# Altium schematic sheet Cabinet_Host.SchDoc
size A4
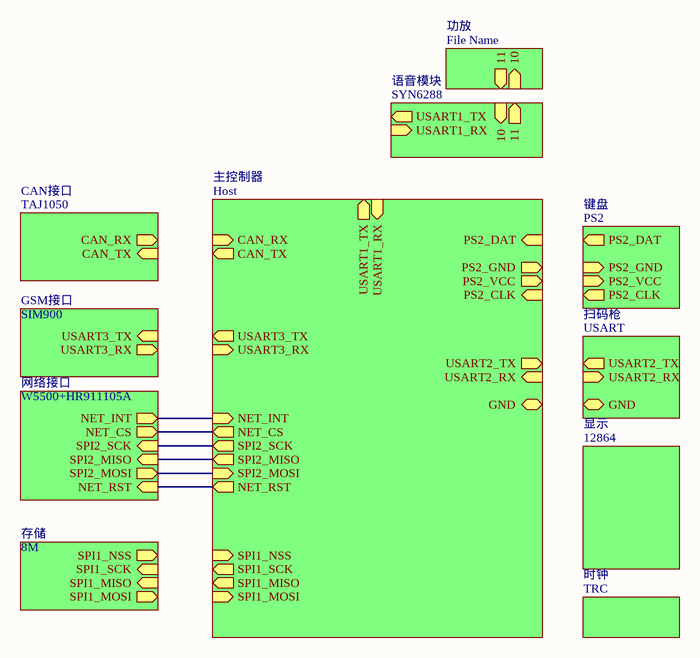
[diagram p0: Cabinet_Host.SchDoc]

## Sub-sheets
CAN接口 = TAJ1050: CAN_RX (out), CAN_TX (in)
GSM接口 = SIM900: USART3_RX (out), USART3_TX (in)
主控制器 = Host: CAN_TX (out), CAN_RX (in), NET_CS (out), SPI2_SCK (out), SPI2_MISO (out), SPI2_MOSI (in), USART3_TX (out), USART3_RX (in), USART2_TX (out), USART2_RX (in), PS2_DAT (in), PS2_GND (out), PS2_VCC (out), PS2_CLK (in), SPI1_NSS (in), SPI1_SCK (out), SPI1_MISO (out), SPI1_MOSI (in), USART1_TX (out), USART1_RX (in), GND, NET_RST (out), NET_INT (in)
功放 = File Name: 10 (in), 11 (out)
存储 = 8M: SPI1_NSS (out), SPI1_MISO (in), SPI1_MOSI (out), SPI1_SCK (in)
扫码枪 = USART: USART2_TX (out), USART2_RX (in), GND  | Value: 5V 500mA
时钟 = TRC: no entries
显示 = 12864: no entries
网络接口 = W5500+HR911105A: NET_CS (out), SPI2_MISO (in), SPI2_MOSI (out), SPI2_SCK (in), NET_RST (in), NET_INT (out)
语音模块 = SYN6288: USART1_TX (out), USART1_RX (in), 10 (in), 11 (out)
键盘 = PS2: PS2_DAT (out), PS2_GND (in), PS2_VCC (in), PS2_CLK (out)  | model: YLGF HS87-S16

## Nets
(unnamed): sheet 主控制器/NET_CS, sheet 网络接口/NET_CS
(unnamed): sheet 主控制器/SPI2_SCK, sheet 网络接口/SPI2_SCK
(unnamed): sheet 主控制器/SPI2_MISO, sheet 网络接口/SPI2_MISO
(unnamed): sheet 主控制器/SPI2_MOSI, sheet 网络接口/SPI2_MOSI
(unnamed): sheet 主控制器/NET_RST, sheet 网络接口/NET_RST
(unnamed): sheet 主控制器/NET_INT, sheet 网络接口/NET_INT